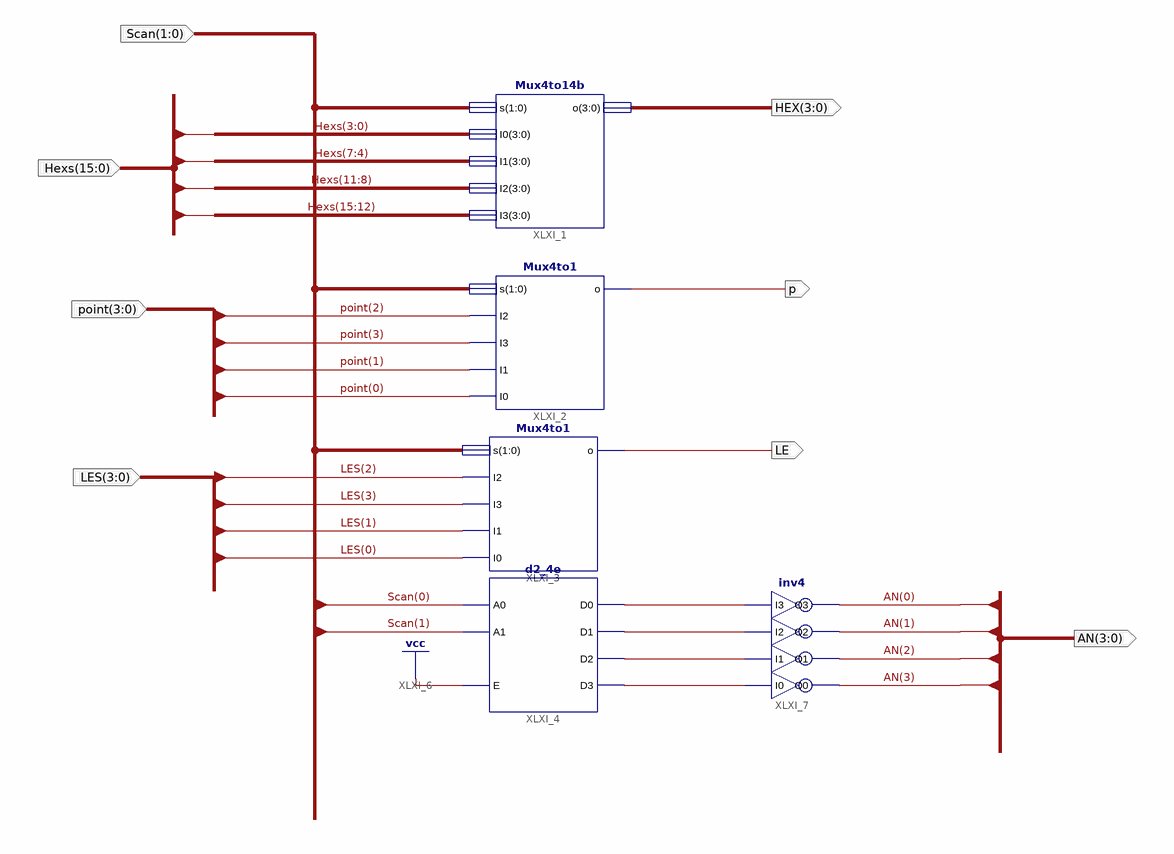
[diagram p0: schematic sheet 1]
// Xilinx ISE schematic DisplaySync.sch (kintex7) as structural Verilog: 5 symbols, 8 ports
module DisplaySync (
  input  [1:0] Scan,
  input  [15:0] Hexs,
  input  [3:0] point,
  input  [3:0] LES,
  output [3:0] HEX,
  output p,
  output LE,
  output [3:0] AN
);

  wire XLXN_25, XLXN_26, XLXN_27, XLXN_28;

  Mux4to14b XLXI_1 (.s(Scan), .I0(Hexs[3:0]), .I1(Hexs[7:4]), .I2(Hexs[11:8]), .I3(Hexs[15:12]), .o(HEX));
  Mux4to1 XLXI_2 (.s(Scan), .I2(point[2]), .I3(point[3]), .I1(point[1]), .I0(point[0]), .o(p));
  Mux4to1 XLXI_3 (.s(Scan), .I2(LES[2]), .I3(LES[3]), .I1(LES[1]), .I0(LES[0]), .o(LE));
  d2_4e XLXI_4 (.A0(Scan[0]), .A1(Scan[1]), .E(1'b1), .D0(XLXN_25), .D1(XLXN_26), .D2(XLXN_27), .D3(XLXN_28));
  inv4 XLXI_7 (.I0(XLXN_28), .I1(XLXN_27), .I2(XLXN_26), .I3(XLXN_25), .O0(AN[3]), .O1(AN[2]), .O2(AN[1]), .O3(AN[0]));
endmodule
